# EasyEDA Pro project zdiy1.eprj, board PCB1
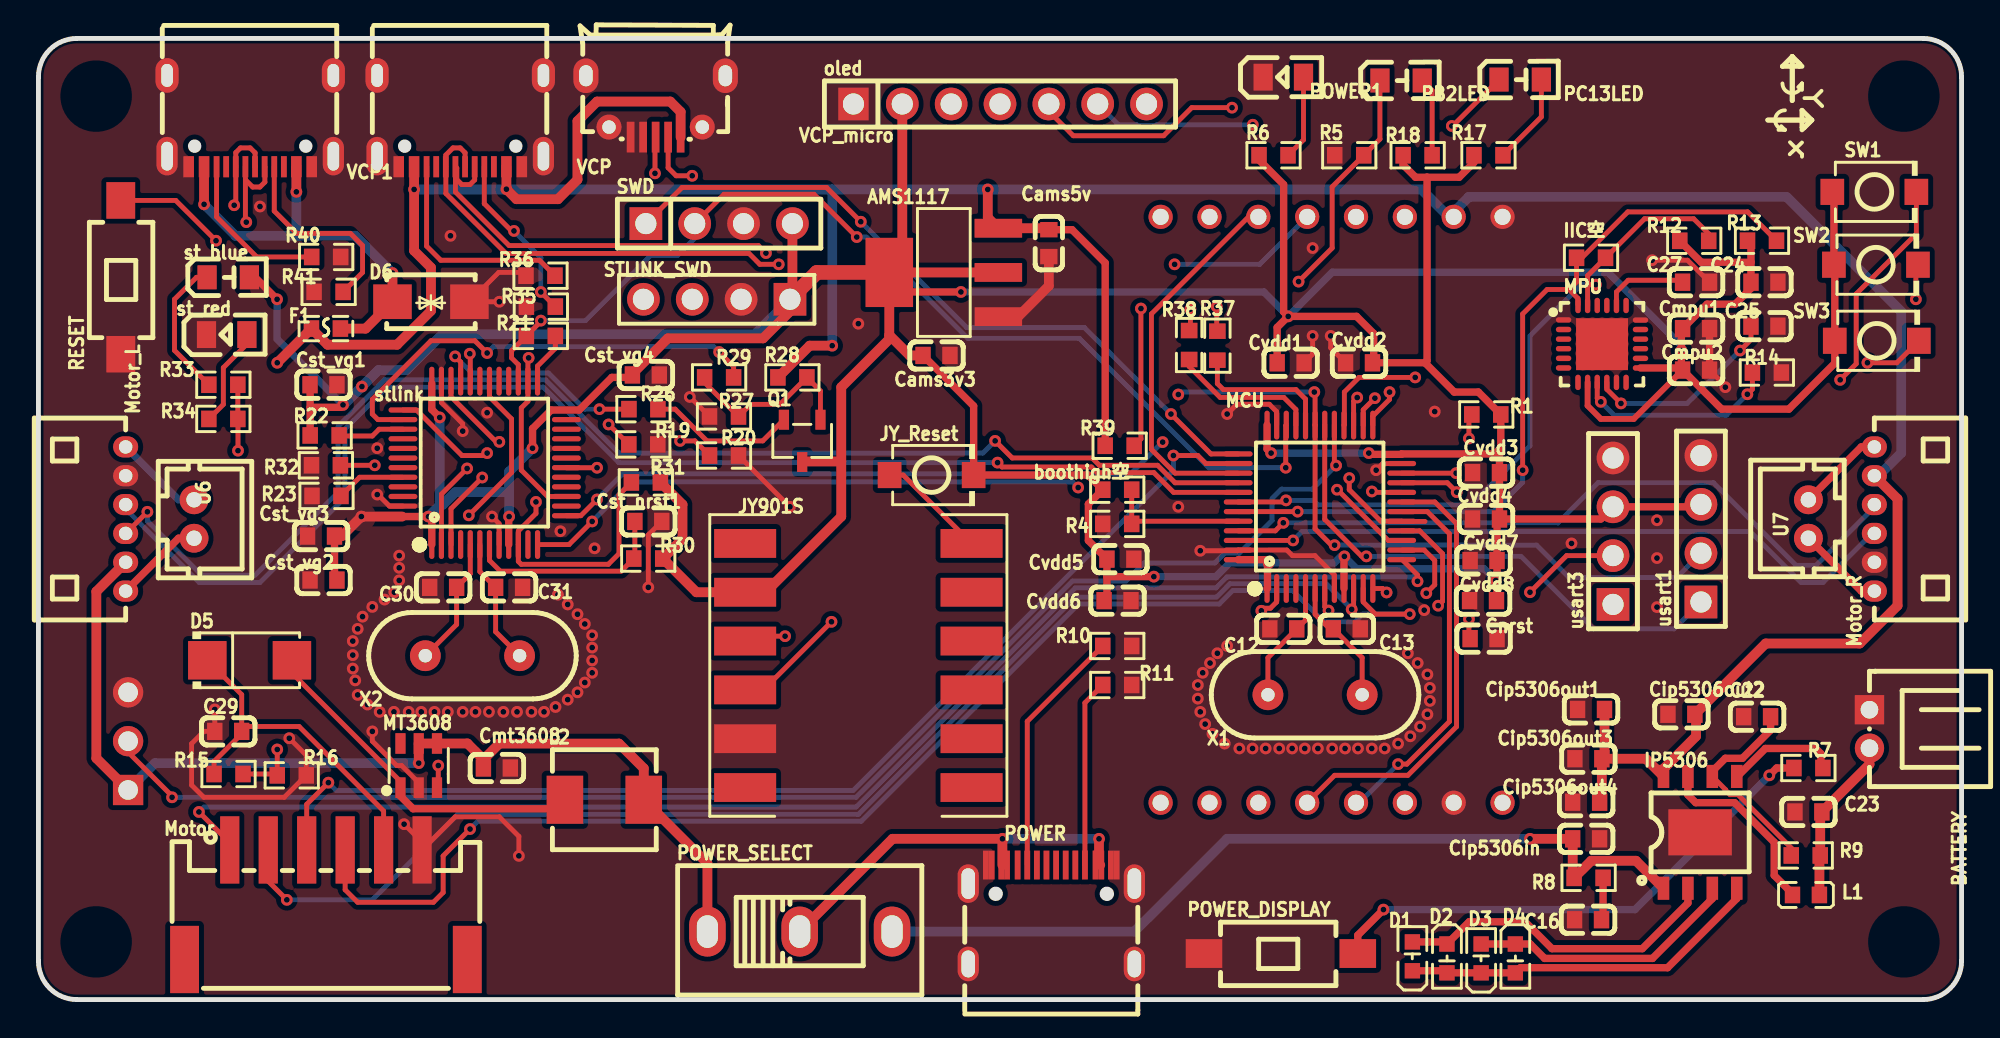
[diagram p4: board, top side]
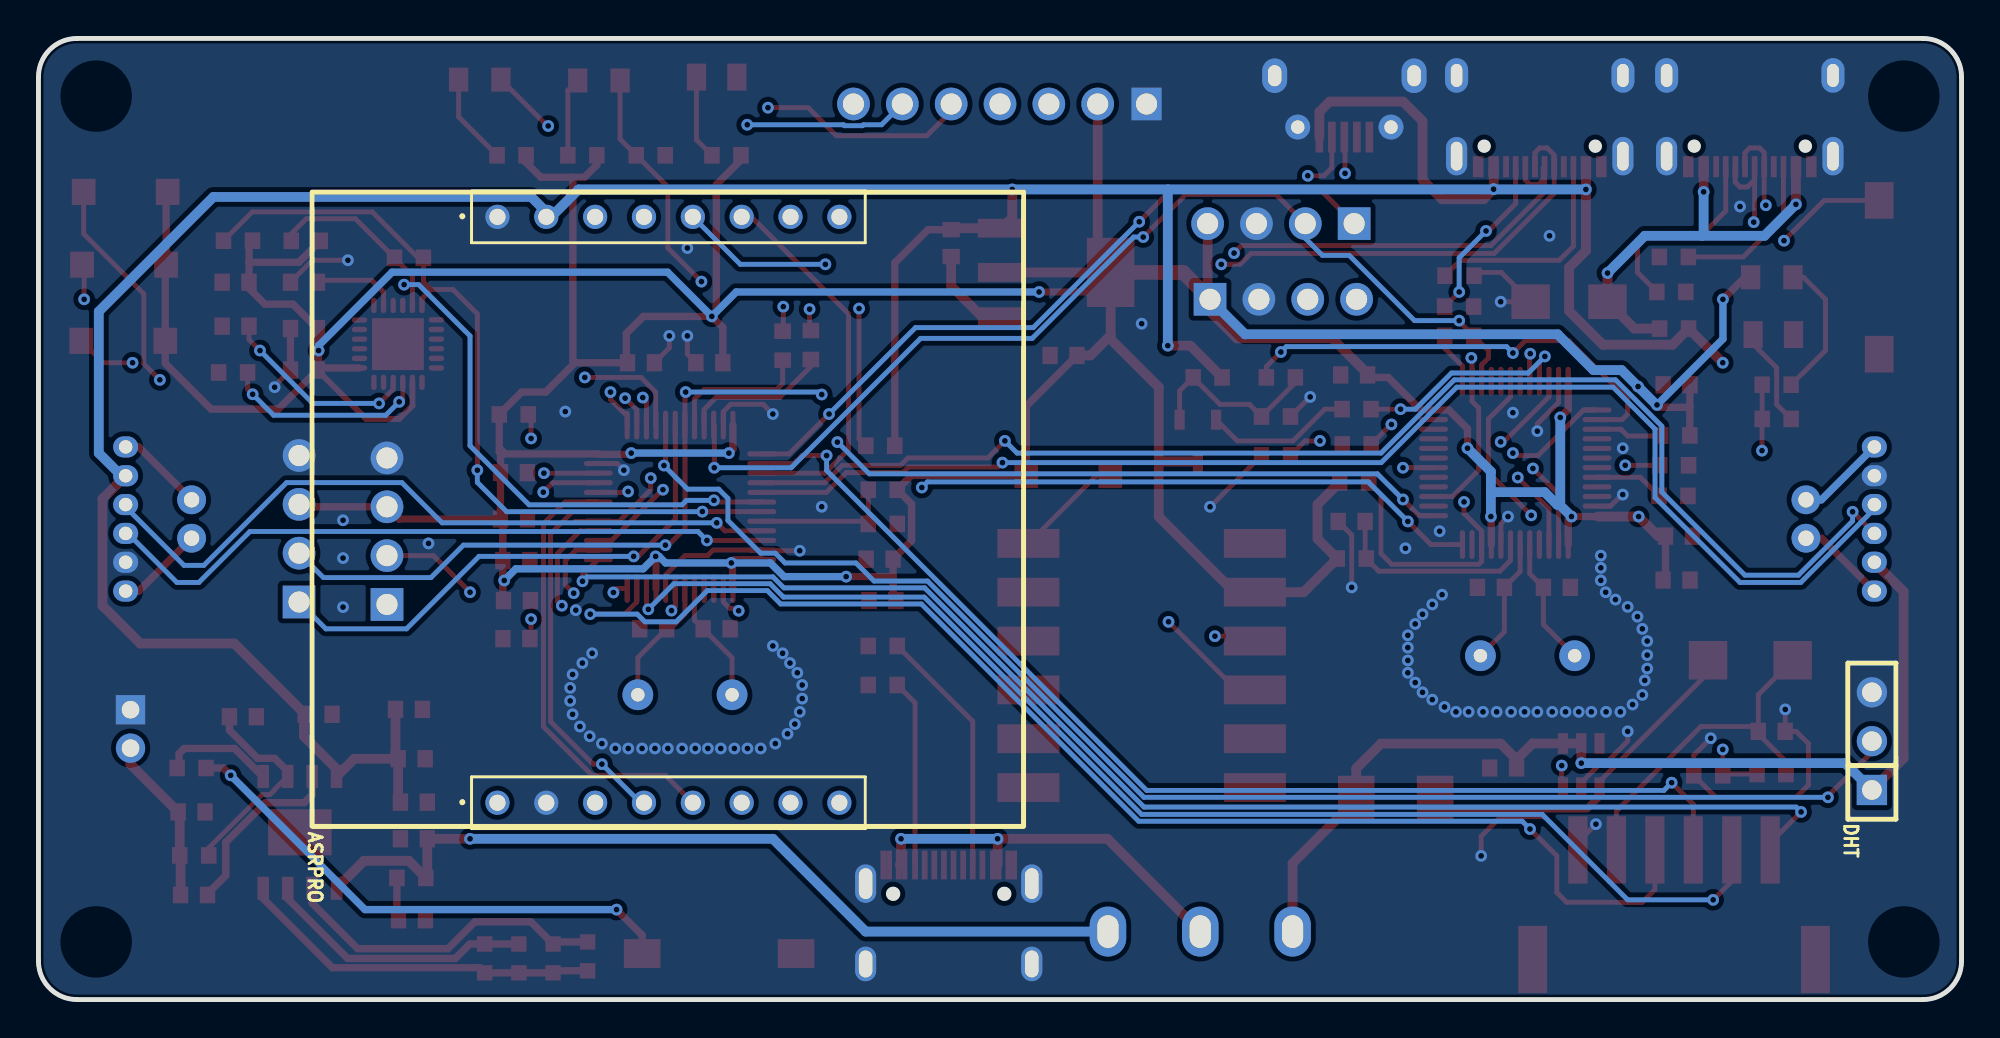
[diagram p5: board, bottom side, seen from below]

Outline 100 x 50 mm; copper layers: Top Layer, Inner1, Inner2, Bottom Layer. Coordinates in mm from the lower left corner of the outline.
Outline path: 0,48 0,2 arc(0.59,0.59) 2,0 98,0 arc(99.41,0.59) 100,2 100,48 arc(99.41,49.41) 98,50 2,50 arc(0.59,49.41) 0,48
Stack: Top Layer 0.035mm 外层铜厚1oz / Dielectric1 0.2104mm 7628 RC49% 8.6mil / Inner1 0.0152mm 内层铜厚 / Dielectric2 1.065mm 1.1mm H/HOZ Copper / Inner2 0.0152mm 内层铜厚 / Dielectric3 0.2104mm 7628 RC49% 8.6mil / Bottom Layer 0.035mm 外层铜厚1oz

## Design rules (mm)
net PA11: DP2
net PA12: DP2
net ST_USB+: DP3
net ST_USB-: DP3
net USB_DM: DP4
net USB_DP: DP4
template: 自定义配置
spacing copperThickness1oz (default): track to track 0.102, other pairs 0.152 to 0.3
spacing copperThickness2oz: track to track 0.203, other pairs 0.152 to 0.3
track width copperThickness1oz (default): min 0.127, default 0.254, max 2.54
track width copperThickness2oz: min 0.203, default 0.254, max 2.54
differential pair differentialPair (default): width min 0.127, default 0.254, max 2.54; gap min 0.152, default 0.152
via viaSize (default): diameter min 0.5, default 0.61, max 10; hole min 0.3, default 0.305, max 6.3
net GND uses copperRegion2
net +5V uses copperRegion2

## Placement (name value [footprint] x y rotation side)
AMS1117  AMS1117-3.3  [SOT-223-4_L6.5-W3.5-P2.30-LS7.0-BR]  47.08 37.83 0 top
ASRPRO  ASRPRO  [asrpro_fz]  67.27 25.51 90 bottom
BATTERY  WAFER-PH2.0-2PWZ  [CONN-TH_2P-P2.00_GP01-2001WR-2P]  95.21 14.08 270 top
boothigh空  10kΩ  [R0603]  56.1 26.52 180 top
C12  20pF  [C0603]  64.73 19.28 0 top
C13  20pF  [C0603]  68.03 19.28 180 top
C16  10uF  [C0603]  80.58 4.15 0 top
C22  22uF  [C0603]  89.37 14.71 0 top
C23  22uF  [C0603]  92.04 9.76 180 top
C24  10nF  [C0603]  89.75 37.32 0 top
C25  100nF  [C0603]  89.75 35.03 180 top
C27  2.2nF  [C0603]  86.19 37.32 180 top
C29  22uF  [C0603]  9.87 13.95 0 top
C30  20pF  [C0603]  21.04 21.44 0 top
C31  20pF  [C0603]  24.47 21.44 180 top
Cams3v3  2.2uF  [C0603]  46.7 33.51 0 top
Cams5v  2.2u  [C0603]  52.54 39.35 270 top
Cip5306in  10uF  [C0603]  80.48 8.36 180 top
Cip5306out1  22uF  [C0603]  80.73 15.09 180 top
Cip5306out2  22uF  [C0603]  85.43 14.84 180 top
Cip5306out3  22uF  [C0603]  80.6 12.53 180 top
Cip5306out4  22uF  [C0603]  80.48 10.27 180 top
Cmpu1  100nF  [C0603]  86.19 34.91 180 top
Cmpu2  22uF  [C0603]  86.19 32.75 180 top
Cmt3608  22uF  [C0603]  23.84 12.05 180 top
Cnrst  100nF  [C0603]  75.15 18.78 0 top
Cst_nrst1  100nF  [C0603]  31.71 24.87 0 top
Cst_vg1  100nF  [C0603]  14.82 31.98 0 top
Cst_vg2  100nF  [C0603]  14.82 21.83 180 top
Cst_vg3  100nF  [C0603]  14.69 24.11 180 top
Cst_vg4  100nF  [C0603]  31.59 32.49 0 top
Cvdd1  100nF  [C0603]  65.11 33.13 180 top
Cvdd2  100nF  [C0603]  68.67 33.13 0 top
Cvdd3  100nF  [C0603]  75.27 27.41 0 top
Cvdd4  100nF  [C0603]  75.27 25 0 top
Cvdd5  100nF  [C0603]  56.26 22.91 180 top
Cvdd6  4.7uF  [C0603]  56.11 20.75 180 top
Cvdd7  1uF  [C0603]  75.15 22.84 0 top
Cvdd8  10nF  [C0603]  75.12 20.75 180 top
D1  XL-J1608UGC-06  [LED-SMD_XL-J1608UYC-06]  71.44 2.25 270 top
D2  XL-J1608UGC-06  [LED-SMD_XL-J1608UYC-06]  73.24 2.14 90 top
D3  XL-J1608UGC-06  [LED-SMD_XL-J1608UYC-06]  75.02 2.14 270 top
D4  XL-J1608UGC-06  [LED-SMD_XL-J1608UYC-06]  76.8 2.14 90 top
D5  SS34  [SMA_L4.3-W2.6-LS5.2-RD]  10.98 17.65 0 top
D6  SMAJ6.8CA  [SMA_L4.4-W2.6-LS5.0-BI]  20.41 36.3 0 top
DHT  PM254V-11-03-H85  [HDR-TH_3P-P2.54-V-F]  4.66 13.44 90 bottom
F1  BSMD0603-050-6V  [F0603]  14.95 34.91 180 top
IIC空  4.7kΩ  [R0603]  80.73 38.59 180 top
IP5306  IP5306  [ESOP-8_L4.9-W3.9-P1.27-LS6.0-BL-EP]  86.41 8.7 0 top
JY901S  -  [JY901S]  42.63 17.38 0 top
JY_Reset  TS-1088R-02026  [SW-SMD_L3.9-W3.0-P4.45]  46.44 27.29 0 top
L1  1uH  [L0603]  91.91 5.44 0 top
L2  4.7uH  [IND-SMD_L5.4-W5.2_FXL0530]  29.43 10.39 0 top
MCU  STM32F103CBT6  [LQFP-48_L7.0-W7.0-P0.50-LS9.0-BL]  66.64 25.64 0 top
Motor  WAFER-PH2.0-6PWB  [CONN-SMD_6P-P2.00_XUNPU_WAFER-PH2.0-6PWB]  14.95 4.93 0 top
Motor_L  HC-ZH1.5-6AW  [CONN-TH_6P-P1.50_HCTL_C-ZH1.5-6AW]  4.53 25 270 top
Motor_R  HC-ZH1.5-6AW  [CONN-TH_6P-P1.50_HCTL_C-ZH1.5-6AW]  95.47 25 90 top
MPU  MPU-6050  [QFN-24_L4.0-W4.0-P0.50-BL-EP2.7]  81.31 34.11 270 top
MT3608  MT3608  [SOT-23-6_L2.9-W1.6-P0.95-LS2.8-BL]  19.77 12.17 0 top
oled  PM254V-11-07-H85  [HDR-TH_7P-P2.54-V-F]  50 46.59 0 top
PB2LED  XL-2012UBC  [LED0805-RD]  70.86 47.81 0 top
PC13LED  XL-2012UBC  [LED0805-RD]  77.05 47.86 0 top
POWER  TYPE-C母座16P不绣钢  [TYPE-C-SMD_16P-EH4]  52.67 4.43 0 top
POWER1  NCD0805R1  [LED0805-R-RD]  64.73 47.99 0 top
POWER_DISPLAY  TS-1101-C-W  [SW-SMD_L6.0-W3.3-LS8.0]  64.6 2.39 0 top
POWER_SELECT  SS-12D10G3-G  [SW-TH_3P-L12.7-W6.7-P4.80_SS-12D10G10-G]  39.59 3.54 0 top
Q1  S8050 J3Y(RANGE:200-350)  [SOT-23-3_L3.0-W1.7-P0.95-LS2.9-BR]  39.71 29.06 90 top
R1  5.1kΩ  [R0603]  75.29 30.44 180 top
R4  4.7kΩ  [R0603]  56.1 24.75 0 top
R5  4.7kΩ  [R0603]  68.16 43.92 0 top
R6  4.7kΩ  [R0603]  64.22 43.92 0 top
R7  10kΩ  [R0603]  92.04 12.05 0 top
R8  2Ω  [R0603]  80.61 6.33 180 top
R9  500mΩ  [R0603]  91.9 7.5 0 top
R10  5.1kΩ  [R0603]  56.1 18.4 0 top
R11  5.1kΩ  [R0603]  56.1 16.36 180 top
R12  4.7kΩ  [R0603]  86.1 39.47 180 top
R13  4.7kΩ  [R0603]  89.62 39.48 180 top
R14  4.7kΩ  [R0603]  89.88 32.62 180 top
R15  9kΩ  [R0603]  9.88 11.73 180 top
R16  1kΩ  [R0603]  13.17 11.67 180 top
R17  4.7kΩ  [R0603]  75.4 43.92 0 top
R18  4.7kΩ  [R0603]  71.72 43.92 0 top
R19  10kΩ  [R0603]  31.45 28.88 180 top
R20  10kΩ  [R0603]  35.65 28.3 180 top
R21  100Ω  [R0603]  26.12 34.53 180 top
R22  4.7kΩ  [R0603]  14.88 29.35 180 top
R23  10kΩ  [R0603]  14.98 26.2 180 top
R26  1.5kΩ  [R0603]  31.46 30.72 180 top
R27  36kΩ  [R0603]  35.65 30.33 0 top
R28  10kΩ  [R0603]  39.21 32.37 180 top
R29  100Ω  [R0603]  35.4 32.37 0 top
R30  5.1kΩ  [R0603]  31.71 22.94 180 top
R31  5.1kΩ  [R0603]  31.59 26.91 180 top
R32  5.1kΩ  [R0603]  14.95 27.79 180 top
R33  510Ω  [R0603]  9.61 31.98 180 top
R34  510Ω  [R0603]  9.61 30.21 180 top
R35  5.1kΩ  [R0603]  26.12 36.05 0 top
R36  5.1kΩ  [R0603]  26.11 37.66 0 top
R37  100Ω  [R0603]  61.3 34.02 90 top
R38  100Ω  [R0603]  59.83 34.05 90 top
R39  10kΩ  [R0603]  56.22 28.81 180 top
R40  5.1kΩ  [R0603]  14.96 38.63 180 top
R41  5.1kΩ  [R0603]  15.09 36.82 0 top
RESET  TS-1101-C-W  [SW-SMD_L6.0-W3.3-LS8.0]  4.28 37.57 90 top
st_blue  XL-2012UBC  [LED0805-RD]  9.87 37.57 0 top
st_red  NCD0805R1  [LED0805-R-RD]  9.79 34.59 0 top
stlink  STM32F103CBT6  [LQFP-48_L7.0-W7.0-P0.50-LS9.0-BL]  23.2 27.92 0 top
STLINK_SWD  IPCP254M04PB08V  [HDR-TH_4P-P2.54-V-M-1]  35.27 36.43 180 top
SW1  TS-1088R-02026  [SW-SMD_L3.9-W3.0-P4.45]  95.47 42.02 0 top
SW2  TS-1088R-02026  [SW-SMD_L3.9-W3.0-P4.45]  95.55 38.23 0 top
SW3  TS-1088R-02026  [SW-SMD_L3.9-W3.0-P4.45]  95.59 34.27 0 top
SWD  2.54-1*4P母  [HDR-TH_4P-P2.54-V-F]  35.4 40.37 0 top
U6  WAFER-PH2.0-2PZZ  [CONN-TH_2P-P2.00_HC-PH-2A-M]  8.09 25 270 top
U7  WAFER-PH2.0-2PZZ  [CONN-TH_2P-P2.00_HC-PH-2A-M]  92.04 25 90 top
usart1  PZ254V-11-04P  [HDR-TH_4P-P2.54-V-M]  86.45 24.49 90 top
usart3  PZ254V-11-04P  [HDR-TH_4P-P2.54-V-M]  81.88 24.36 90 top
VCP  TYPE-C 16PIN 2MD(073)  [USB-C-SMD_TYPE-C-6PIN-2MD-073]  21.93 45.7 180 top
VCP1  TYPE-C 16PIN 2MD(073)  [USB-C-SMD_TYPE-C-6PIN-2MD-073]  11.01 45.7 180 top
VCP_micro  MicroXNJ  [MICRO-USB-SMD_MICROXNJ]  32.09 46.46 180 top
X1  8MHz  [OSC-TH_L10.0-W4.5-P5.00]  66.38 15.86 90 top
X2  8MHz  [OSC-TH_L10.0-W4.5-P5.00]  22.57 17.89 90 top

## Footprints (pads in the part's own frame, mm; a bottom-side part is the same pattern mirrored in y, then rotated)
asrpro_fz
  round 1.26 hole 0.84: 1(-15.269,8.861) 2(-15.269,6.321) 3(-15.269,3.781) 4(-15.269,1.241) 5(-15.269,-1.299) 6(-15.269,-3.839) 7(-15.269,-6.379) 8(-15.269,-8.919) 9(15.211,-8.919) 10(15.211,-6.379) 11(15.211,-3.839) 12(15.211,-1.299) 13(15.211,1.241) 14(15.211,3.781) 15(15.211,6.321) 16(15.211,8.861)
C0603
  rect 0.8x0.9 smd: 1(-0.7,0) 2(0.7,0)
CONN-SMD_6P-P2.00_XUNPU_WAFER-PH2.0-6PWB
  rect 1x3.5 smd: 1(-5,2.85) 2(-3,2.85) 3(-1,2.85) 4(1,2.85) 5(3,2.85) 6(5,2.85)
  rect 1.5x3.5 smd: 7(-7.35,-2.85) 8(7.35,-2.85)
CONN-TH_2P-P2.00_GP01-2001WR-2P
  rect 1.524x1.524 hole 0.914: 1(-1,0)
  round 1.524 hole 0.914: 2(1,0)
CONN-TH_2P-P2.00_HC-PH-2A-M
  round 1.5 hole 0.8: 1(-1,0) 2(1,0)
CONN-TH_6P-P1.50_HCTL_C-ZH1.5-6AW
  oval 1.1x1.3 hole 0.7: 1(-3.75,0) 2(-2.25,0) 3(-0.75,0) 4(0.75,0) 5(2.25,0) 6(3.75,0)
ESOP-8_L4.9-W3.9-P1.27-LS6.0-BL-EP
  rect 0.6x1.2 smd: 1(-1.905,-2.909) 2(-0.635,-2.909) 3(0.635,-2.909) 4(1.905,-2.909) 5(1.905,2.909) 6(0.635,2.909) 7(-0.635,2.909) 8(-1.905,2.909)
  rect 3.3x2.4 smd: 9(0,0)
F0603
  rect 0.806x0.864 smd: 1(-0.753,0) 2(0.753,0)
HDR-TH_3P-P2.54-V-F
  rect 1.575x1.575 hole 1.02: 1(-2.54,0)
  round 1.575 hole 1.02: 2(0,0) 3(2.54,0)
HDR-TH_4P-P2.54-V-F
  rect 1.7x1.7 hole 1.1: 1(-3.81,0)
  round 1.7 hole 1.1: 2(-1.27,0) 3(1.27,0) 4(3.81,0)
HDR-TH_4P-P2.54-V-M
  rect 1.7x1.7 hole 1.1: 1(-3.81,0)
  round 1.7 hole 1.1: 2(-1.27,0) 3(1.27,0) 4(3.81,0)
HDR-TH_4P-P2.54-V-M-1
  rect 1.7x1.7 hole 1.1: 1(-3.81,0)
  round 1.7 hole 1.1: 2(-1.27,0) 3(1.27,0) 4(3.81,0)
HDR-TH_7P-P2.54-V-F
  rect 1.575x1.7 hole 1.1: 1(-7.62,0)
  round 1.7 hole 1.1: 2(-5.08,0) 3(-2.54,0) 4(0,0) 5(2.54,0) 6(5.08,0) 7(7.62,0)
IND-SMD_L5.4-W5.2_FXL0530
  rect 1.9x2.5 smd: 1(-2.05,0) 2(2.05,0)
JY901S
  rect 3.225x1.5 smd: 1(-5.888,6.35) 2(-5.888,3.81) 3(-5.888,1.27) 4(-5.888,-1.27) 5(-5.888,-3.81) 6(-5.888,-6.35) 7(5.888,-6.35) 8(5.888,-3.81) 9(5.888,-1.27) 10(5.888,1.27) 11(5.888,3.81) 12(5.888,6.35)
L0603
  rect 0.8x0.864 smd: 1(-0.7,0) 2(0.7,0)
LED0805-R-RD
  rect 1x1.399 smd: 1(1.05,0) 2(-1.05,0)
LED0805-RD
  rect 1x1.25 smd: 1(-1.1,0) 2(1.1,0)
LED-SMD_XL-J1608UYC-06
  rect 0.8x0.8 smd: 1(0.75,0) 2(-0.75,0)
LQFP-48_L7.0-W7.0-P0.50-LS9.0-BL
  oval 0.27x1.5 smd: 1(-2.75,-4.25) 2(-2.25,-4.25) 3(-1.75,-4.25) 4(-1.25,-4.25) 5(-0.75,-4.25) 6(-0.25,-4.25) 7(0.25,-4.25) 8(0.75,-4.25) 9(1.25,-4.25) 10(1.75,-4.25) 11(2.25,-4.25) 12(2.75,-4.25) 25(2.75,4.25) 26(2.25,4.25) 27(1.75,4.25) 28(1.25,4.25) 29(0.75,4.25) 30(0.25,4.25) 31(-0.25,4.25) 32(-0.75,4.25) 33(-1.25,4.25) 34(-1.75,4.25) 35(-2.25,4.25) 36(-2.75,4.25)
  oval 1.5x0.27 smd: 13(4.25,-2.75) 14(4.25,-2.25) 15(4.25,-1.75) 16(4.25,-1.25) 17(4.25,-0.75) 18(4.25,-0.25) 19(4.25,0.25) 20(4.25,0.75) 21(4.25,1.25) 22(4.25,1.75) 23(4.25,2.25) 24(4.25,2.75) 37(-4.25,2.75) 38(-4.25,2.25) 39(-4.25,1.75) 40(-4.25,1.25) 41(-4.25,0.75) 42(-4.25,0.25) 43(-4.25,-0.25) 44(-4.25,-0.75) 45(-4.25,-1.25) 46(-4.25,-1.75) 47(-4.25,-2.25) 48(-4.25,-2.75)
MICRO-USB-SMD_MICROXNJ
  rect 0.4x1.6 smd: 1(-1.3,1.597) 2(-0.65,1.597) 3(0,1.597) 4(0.65,1.597) 5(1.3,1.597)
  round 1.3 hole 0.7: 6(2.425,1.074) 9(-2.425,1.073)
  oval 1.3x1.8 hole 0.7x1.1: 7(3.625,-1.597) 8(-3.625,-1.597)
OSC-TH_L10.0-W4.5-P5.00
  round 1.6 hole 0.7: 1(0,2.45) 2(0,-2.45)
QFN-24_L4.0-W4.0-P0.50-BL-EP2.7
  oval 0.28x0.8 smd: 1(-1.25,-2) 2(-0.75,-2) 3(-0.25,-2) 4(0.25,-2) 5(0.75,-2) 6(1.25,-2) 13(1.25,2) 14(0.75,2) 15(0.25,2) 16(-0.25,2) 17(-0.75,2) 18(-1.242,2)
  oval 0.8x0.28 smd: 7(2,-1.25) 8(2,-0.75) 9(2,-0.25) 10(2,0.25) 11(2,0.75) 12(2,1.25) 19(-2,1.25) 20(-2,0.75) 21(-2,0.25) 22(-2,-0.25) 23(-2,-0.75) 24(-2,-1.25)
  rect 2.7x2.7 smd: 25(0.013,0)
R0603
  rect 0.806x0.864 smd: 1(-0.753,0) 2(0.753,0)
SMA_L4.3-W2.6-LS5.2-RD
  rect 2x2 smd: 1(-2.2,0) 2(2.2,0)
SMA_L4.4-W2.6-LS5.0-BI
  rect 2x1.8 smd: 1(-2,0) 2(2,0)
SOT-23-3_L3.0-W1.7-P0.95-LS2.9-BR
  rect 1.038x0.532 smd: 1(1.101,-0.95) 2(1.101,0.95) 3(-1.101,0)
SOT-23-6_L2.9-W1.6-P0.95-LS2.8-BL
  rect 0.532x1.072 smd: 1(-0.95,-1.149) 2(0,-1.149) 3(0.95,-1.149) 4(0.95,1.149) 5(0,1.149) 6(-0.95,1.149)
SOT-223-4_L6.5-W3.5-P2.30-LS7.0-BR
  rect 2.47x0.98 smd: 1(2.835,-2.3) 2(2.835,0) 3(2.835,2.3)
  rect 2.47x3.6 smd: 4(-2.835,0)
SW-SMD_L3.9-W3.0-P4.45
  rect 1.23x1.36 smd: 1(-2.185,0) 2(2.185,0)
SW-SMD_L6.0-W3.3-LS8.0
  rect 1.9x1.5 smd: 1(-4,0) 2(4,0)
SW-TH_3P-L12.7-W6.7-P4.80_SS-12D10G10-G
  oval 1.9x2.6 hole 1.1x1.7: 1(-4.8,0) 2(0,0) 3(4.8,0)
TYPE-C-SMD_16P-EH4
  oval 1.1x2 hole 0.7x1.6: 1(-4.32,1.606) 1(4.32,1.606)
  oval 1.1x1.8 hole 0.7x1.4: 1(-4.32,-2.574) 1(4.32,-2.574)
  rect 0.3x1.5 smd: A1(-3.4,2.573) A4(-2.6,2.573) A5(-1.25,2.573) A6(-0.25,2.573) A7(0.25,2.573) A8(1.25,2.574) A9(2.6,2.574) A12(3.4,2.573) B1(3.1,2.573) B4(2.3,2.574) B5(1.75,2.573) B6(0.75,2.573) B7(-0.75,2.573) B8(-1.75,2.574) B9(-2.3,2.573) B12(-3.1,2.573)
USB-C-SMD_TYPE-C-6PIN-2MD-073
  rect 0.55x1.1 smd: 1(-3.2,2.375) 2(-2.4,2.375) 11(2.4,2.375) 12(3.2,2.375)
  rect 0.3x1.1 smd: 3(-1.75,2.375) 4(-1.25,2.375) 5(-0.75,2.375) 6(-0.25,2.375) 7(0.25,2.375) 8(0.75,2.375) 9(1.25,2.375) 10(1.75,2.375)
  oval 1.1x2 hole 0.6x1.5: 13(-4.325,1.825) 14(4.325,1.825)
  oval 1.2x1.8 hole 0.6x1.2: 13(-4.325,-2.375) 14(4.325,-2.375)

## Nets
As in the schematic.

Pads without a net: ASRPRO 1 3 6 7 8 9 10 13 14; JY901S 1 6 7 8 9 10 11; Motor 7 8; MPU 2 3 4 5 6 7 12 14 15 16 17 19 21 22; MT3608 6; POWER A6 A7 A8 B6 B7 B8; stlink 4 11 14 16 17 19 21 22 28 29 31 40 41 42 43 45 46; VCP 3 9; VCP1 3 9

## Via types
v1: diameter 0.61, hole 0.305, Top Layer to Bottom Layer, 230 vias

## Routing (per net, layer and track width the routed paths; a pad name or vN(x,y) marks a point on that pad's centre or on a via; arc(x,y) is an arc through that point)
3V3: length 355.9
  Top Layer w0.305: Cmpu2.2 82.96,30.21 81.24,30.21 80.56,30.89 MPU.8
  Top Layer w0.381: Cst_vg1.1 14.13,31.98 14.13,30.81 ; R22.2 14.13,30.81 ; 14.13,30.81 15.71,30.81 v1(15.84,30.94) ; 89.05,38.36 86.46,38.36 R12.2 ; 89.05,38.36 89.05,39.3 R13.2 ; 89.05,38.36 C24.1 89.05,37 88.23,36.18 86.76,36.18 Cmpu1.2 85.43,34.84 v1(85.43,33.76) 85.43,32.81 85.38,32.86 MPU.13 ; R18.1 70.96,43.42 71.61,42.78 72.21,42.78 ; stlink.24 26.66,30.67 25.69,29.7 v1(25.69,28.68) ; MCU.36 63.89,28.64 v1(64.1,28.43) ; Cst_vg3.1 15.39,21.95 Cst_vg2.1 ; 72.21,42.78 73.88,42.78 74.65,43.55 R17.1 ; 72.21,42.78 72.21,33.24 72.1,33.13 ; AMS1117.4 45.26,36.81 v1(47.97,36.81) ; stlink.1 20.45,24.96 v1(20.28,25.13) 19,25.13 ; v1(64.99,35.54) 64.75,35.78 64.75,42.4 63.47,43.68 R6.1 ; v1(64.99,35.54) 68.54,35.54 69.43,34.65 69.43,33.19 Cvdd2.2 72.1,33.13 ; v1(64.99,35.54) 64.41,34.97 Cvdd1.2 ; 27.58,30.67 28.12,30.67 29.81,32.37 31.01,32.37 ; SW1.1 93.36,41.94 SW2.1 93.41,38.19 SW3.1 93.41,33.1 91.02,30.72 87.53,30.72 Cmpu2.2 ; Cvdd8.1 75.85,20.78 Cvdd7.2 75.85,24.87 Cvdd4.2 ; Cvdd6.2 55.56,20.9 55.56,22 ; 55.56,22 Cvdd5.2 54.6,23.88 54.6,25.78 boothigh空.2 54.58,27.29 JY_Reset.2 48.63,30.88 Cams3v3.1 ; 55.56,22 v1(58,22) ; 72.1,33.13 73.62,31.6 74.88,31.6 R1.1 76.04,28.49 75.97,28.42 ; v1(12.41,36.43) 11.27,37.57 st_blue.2 ; Cvdd4.2 81.24,25 81.88,25.64 86.32,25.64 usart1.3 ; Cvdd4.2 Cvdd3.2 75.97,28.42 ; v1(69.18,28.43) 69.24,28.36 70.86,28.36 MCU.24 75.73,28.39 75.97,28.63 75.97,28.42 ; v1(20.87,30.28) 20.45,30.7 20.45,32.04 ; v1(24.47,25.13) 24.45,25.11 stlink.9 ; MCU.48 63.8,22.89 v1(63.97,22.71) 63.91,22.65 63.91,21.41 MCU.1 ; v1(67.91,23.06) 67.89,23.04 MCU.9
  Top Layer w0.508: 41.75,28 39.75,28 Q1.3 ; 41.75,28 41.75,31.86 44.24,34.36 44.24,34.57 ; 41.75,28 41.75,25.13 37.81,21.19 JY901S.2 34.21,21.19 R30.1 33.49,23.97 33.49,25.75 R31.1 ; 44.24,34.57 45.3,33.51 Cams3v3.1 ; 44.24,34.57 AMS1117.4 ; AMS1117.4 AMS1117.2 ; AMS1117.4 44.92,38.5 oled.2 ; 31.01,32.37 31.01,32.68 32.73,34.4 37.68,34.4 39.08,35.8 STLINK_SWD.1 ; SWD.4 39.21,36.56 ; 18.91,25.13 16.85,25.13 16.82,25.16 15.78,24.11 Cst_vg3.1
  Top Layer w0.762: AMS1117.4 40.47,37.83 39.21,36.56
  Inner1 w0.381: v1(16.82,31.89) 16.82,25.16 v1(16.79,25.13)
  Bottom Layer w0.381: v1(58,22) 61.23,22 61.94,22.71 v1(63.97,22.71) 67.39,22.71 67.73,23.06 v1(67.91,23.06) 68.55,22.41 75.17,22.41 v1(75.78,21.8) ; v1(47.97,36.81) 63.72,36.81 v1(64.99,35.54) 67.28,37.84 81.61,37.84 85.43,34.02 v1(85.43,33.76) ; v1(64.1,28.43) v1(69.18,28.43) ; v1(15.84,30.94) 12.41,34.36 v1(12.41,36.43)
  Bottom Layer w0.508: 24.47,26.4 v1(24.47,25.13) ; 24.47,26.4 24.47,27.46 v1(25.69,28.68) ; 24.47,26.4 21.68,26.4 21.03,25.75 ; 21.03,25.75 20.87,25.91 v1(20.87,30.28) ; 21.03,25.75 20.9,25.75 v1(20.28,25.13) ; STLINK_SWD.1 37.26,34.61 21,34.61 19.14,32.75 17.68,32.75 v1(16.82,31.89) 15.87,30.94 v1(15.84,30.94)
5V_IN: length 20.3
  Top Layer w0.508: 55.21,7 55.15,7.06 v1(55.15,8.36) ; POWER_SELECT.2 44.41,8.36 v1(50.13,8.36) 50.12,8.36 50.12,7
  Bottom Layer w0.508: v1(55.15,8.36) v1(50.13,8.36)
6V: length 18.6
  Top Layer w0.254: R15.2 9.13,12.39 10.57,13.82 C29.2 ; C29.2 10.82,14.2 13.55,14.2 17.95,9.81 Motor.5 ; C29.2 10.57,15.86 D5.1
+5V: length 255.4
  Top Layer w0.381: R39.2 55.47,38.33 53.74,40.05 Cams5v.1
  Top Layer w0.508: R28.2 40.1,34.02 v1(41.27,34.02) ; Cip5306out3.1 81.43,12.67 Cip5306out1.1 ; Cip5306out3.1 83.58,12.53 IP5306.8 84.5,12 86.19,13.7 86.19,14.78 Cip5306out2.1 89.82,18.52 94.7,18.52 96.67,20.49 96.67,26.04 Motor_R.5 ; Cip5306out3.1 81.3,10.38 Cip5306out4.1 ; v1(49.37,42.14) 49.37,40.68 AMS1117.3 52.46,40.13 Cams5v.1 ; 4.66,10.9 3.01,12.55 3.01,21.23 Motor_L.5 ; v1(19.77,12.3) MT3608.5 MT3608.4 22.31,13.32 23.14,12.49 ; VCP_micro.1 33.39,46.18 32.85,46.72 29.04,46.72 28.03,45.7 28.03,42.65 27.01,41.64 24.85,41.64 v1(24.33,42.16) 24.33,43.33 ; VCP.11 v1(19.53,42.14) 19.53,38.96 20.41,38.08 20.41,35.83 18.65,34.07 15.03,34.07 F1.2 v1(12.42,33.13) ; POWER_SELECT.1 34.79,7.08 L2.2 31.48,12.03 30.19,13.32 23.97,13.32 23.14,12.49 Cmt3608.2
  Inner1 w0.508: v1(12.42,33.13) 7.71,33.13 6.44,31.86 6.44,24.66 Motor_L.5
  Bottom Layer w0.508: v1(19.77,12.3) 6.06,12.3 4.66,10.9 ; 41.27,42.14 v1(41.27,34.02) ; 41.27,42.14 v1(49.37,42.14) 71.91,42.14 73.34,40.72 74.38,41.75 90.9,41.75 96.86,35.8 96.86,28.43 95.68,27.25 Motor_R.5 ; 41.27,42.14 v1(19.53,42.14)
GND: length 75.5
  Top Layer w0.254: v1(60.41,23.35) 62.35,23.35 MCU.47 64.91,23.39 65.2,23.09 66.38,23.09 67.39,22.09 MCU.8 ; R36.1 25.18,37.83 23.93,37.83 D6.2 v1(23.97,36.3) ; v1(24.98,7.47) 24.98,8.49 23.97,9.51 21.67,9.51 Motor.6 19.95,8.19 v1(19.01,9.12) ; R27.1 33.88,31.35 v1(33.87,31.35) ; stlink.35 20.95,31.06 22.06,29.95 v1(22.06,29.57) ; v1(17.36,13.95) 17.36,13.44 18.63,12.17 18.89,12.17 19.77,11.28 MT3608.2 ; v1(61.81,30.46) 62.32,30.97 64,30.97 64.39,30.59 MCU.35 ; v1(9.17,15.09) C29.1 8.6,13.95 7.96,13.32 7.96,11.16 8.6,10.52 12.78,10.52 R16.1 13.92,12.71 v1(13.04,13.59) ; v1(39.08,25.64) 39.07,25.64 R20.1 ; v1(67.2,34.53) 67.2,33.9 67.97,33.13 ; v1(66.26,34.53) 66.26,33.57 Cvdd1.1 ; 86.9,37.32 85.75,38.46 v1(83.91,38.46) ; stlink.8 23.95,24.76 v1(23.58,25.13) ; MCU.23 69.9,27.89 v1(69.56,27.54) ; 86.9,32.75 87.72,31.92 v1(87.72,31.86) ; Cst_nrst1.2 31.71,24.17 v1(31.71,21.44) ; v1(17.61,26.27) 17.65,26.27 18.25,25.67 stlink.47
  Top Layer w0.381: 86.9,34.91 86.9,32.75
  Top Layer w0.508: AMS1117.1 50.94,35.53 52.54,37.13 Cams5v.2
  vias: v1(11.52,41.26) v1(16.34,18.65) v1(16.34,17.92) v1(16.34,17.22) v1(16.47,16.6) v1(16.6,19.28) v1(16.6,15.85) v1(16.85,19.92) v1(17.11,15.35) v1(17.36,20.43) v1(17.61,28.68) v1(17.74,14.97) v1(18,20.81) v1(18.5,21.19) v1(18.49,14.97) v1(18.76,23.09) v1(18.76,22.46) v1(18.76,21.81) v1(19.25,14.97) v1(19.91,14.97) v1(20.59,14.97) v1(21.29,14.97) v1(21.42,39.73) v1(22.06,14.97) v1(22.72,14.97) v1(23.33,30.53) v1(23.42,14.97) v1(24.17,14.97) v1(24.89,14.97) v1(25.64,14.97) v1(26.29,14.97) v1(26.89,15.22) v1(27.01,21.06) v1(27.14,24.36) v1(27.52,20.56) v1(27.52,15.6) v1(28.03,20.05) v1(28.03,15.98) v1(28.41,19.54) v1(28.41,16.49) v1(28.79,18.95) v1(28.79,18.31) v1(28.79,17.64) v1(28.79,17) v1(28.92,23.48) v1(42.63,35.16) v1(59.27,25.64) v1(60.29,16.36) v1(60.29,15.66) v1(60.41,14.97) v1(60.54,17) v1(60.67,14.33) v1(60.92,17.51) v1(61.05,13.82) v1(61.3,18.02) v1(61.68,13.32) v1(61.81,18.4) v1(62.45,13.06) v1(63.13,13.06) v1(63.81,13.06) v1(64.52,13.06) v1(65.19,13.06) v1(65.85,13.06) v1(66.26,39.1) v1(66.53,13.06) v1(67.27,13.06) v1(67.94,13.06) v1(68.61,13.06) v1(69.33,13.06) v1(70,13.06) v1(70.7,13.32) v1(71.21,18.02) v1(71.34,13.7) v1(71.72,17.51) v1(71.84,14.2) v1(72.06,20.26) v1(72.22,16.91) v1(72.22,14.84) v1(72.35,16.21) v1(72.35,15.54) v1(72.61,30.59) v1(79.72,23.73) v1(84.16,24.94) v1(84.16,22.97) v1(84.16,20.42)
AIN: length 23.9
  Top Layer w0.254: R31.2 30.19,26.26 30.19,23.2 29.63,22.64 25.11,22.64 24.95,22.79 stlink.10 24.95,24.37 25.87,25.29 v1(25.87,25.89) ; R32.1 v1(17.49,27.79)
  Inner1 w0.254: v1(17.49,27.79) 20.54,27.79 22.44,25.89 v1(25.87,25.89)
ASRPRO_PA0: length 19.3
  Top Layer w0.254: v1(70.7,12.25) 71.16,12.25 73.37,14.46 73.37,24.24 72.22,25.39 MCU.18
  Bottom Layer w0.254: v1(70.7,12.25) 68.69,10.24 68.51,10.24
ASRPRO_PA1: length 23.3
  Top Layer w0.254: 65.97,10.24 67.4,11.67 71.21,11.67 73.74,14.19 73.74,24.76 72.61,25.89 MCU.19
ASRPRO_PA2: length 31.7
  Top Layer w0.254: MCU.12 69.89,21.39 v1(70.1,21.18)
  Inner1 w0.254: v1(59.08,38.25) 60.67,36.66 60.67,30.33 64.1,26.91 65.11,26.91 66.51,25.51 66.51,23.54 67.58,22.47 68.81,22.47 v1(70.1,21.18)
  Bottom Layer w0.254: ASRPRO.12 63.5,38.25 v1(59.08,38.25)
ASRPRO_PA3: length 19.5
  Top Layer w0.254: 63.18,40.72 62.93,40.72 57.87,35.67 57.87,28.62 59.11,27.39 MCU.39
BAT: length 8.6
  Top Layer w0.508: C23.1 95.21,12.23 BATTERY.2 ; L1.2 92.61,7.45 R9.2 92.65,9.67
BOOT0: length 7.4
  Top Layer w0.254: MCU.44 56.99,24.89 R4.2 boothigh空.1
BOOT1: length 26.3
  Top Layer w0.254: PB2LED.1 69.76,44.77 R5.2 67.27,42.28 67.27,39.1 v1(65.53,37.35) ; v1(69.34,26.43) 69.39,26.39 MCU.20
  Inner1 w0.254: v1(69.34,26.43) 69.34,26.79 67.78,28.35 67.78,35.1 v1(65.53,37.35)
DHT_DAT: length 74.4
  Top Layer w0.254: MCU.29 67.39,27.87 v1(67.47,27.78) ; v1(6.95,10.52) 6.95,10.59 4.66,12.87 DHT.2
  Bottom Layer w0.254: v1(6.95,10.52) 42.52,10.52 53.77,21.77 56.55,21.77 57.49,22.71 61.18,22.71 61.68,23.22 62.45,23.22 64.15,24.92 64.15,26.07 64.6,26.52 64.63,26.55 66.25,26.55 v1(67.47,27.78)
ENCODER_LA: length 68.9
  Top Layer w0.254: Motor_L.4 4.54,24.25 v1(5.66,25.37) ; MCU.40 59.1,26.89 58.2,27.79 55.17,27.79 54.79,28.17 50.63,28.17 v1(49.75,29.06)
  Bottom Layer w0.254: v1(5.66,25.37) 5.66,24.9 8.48,22.08 11.27,22.08 15.58,26.4 15.58,29.83 18,32.24 26.37,32.24 30.18,28.43 49.11,28.43 v1(49.75,29.06)
ENCODER_LB: length 68.2
  Top Layer w0.254: v1(49.87,27.93) 50.1,27.71 54.75,27.71 55.05,27.41 58,27.41 59.03,26.39 MCU.41
  Bottom Layer w0.254: v1(49.87,27.93) 30.18,27.93 26.25,31.86 18.12,31.86 15.94,29.68 15.94,26.12 11.52,21.7 8.36,21.7 4.53,25.52 Motor_L.3
ENCODER_RA: length 37.3
  Top Layer w0.254: MCU.45 64.32,24.39 v1(64.73,24.8)
  Bottom Layer w0.254: v1(64.73,24.8) 79.01,24.8 81.1,26.89 87.1,26.89 91.4,22.59 92.43,22.59 95.47,25.62 Motor_R.4
ENCODER_RB: length 35.4
  Top Layer w0.254: MCU.46 v1(65.24,23.89)
  Bottom Layer w0.254: v1(65.24,23.89) 65.71,24.35 89,24.35 91.66,21.7 92.8,21.7 95.35,24.25 Motor_R.3
IP5306_IN: length 45.1
  Top Layer w0.508: v1(77.56,8.36) Cip5306in.2 79.78,6.4 R8.2 80.74,7.22 83.07,7.22 IP5306.1
  Bottom Layer w0.508: POWER_SELECT.3 56.99,3.54 61.81,8.36 v1(77.56,8.36)
L+: length 4.7
  Top Layer w0.381: U6.2 7.28,24 Motor_L.6
L-: length 4.7
  Bottom Layer w0.381: Motor_L.1 7.28,26 U6.1
L_PWM: length 66.9
  Top Layer w0.254: Motor.2 11.95,6.16 v1(12.92,5.19) ; v1(68.29,20.3) 68.39,20.4 MCU.10
  Bottom Layer w0.254: v1(68.29,20.3) 66.96,21.63 61.95,21.63 61.26,20.94 53.94,20.94 42.63,9.63 21.81,9.63 17.36,5.19 v1(12.92,5.19)
L_TURN: length 72.6
  Top Layer w0.254: Motor.1 9.95,8.16 v1(8.34,9.76) ; v1(71.71,21.76) 71.71,22.09 70.91,22.89 MCU.13
  Bottom Layer w0.254: v1(8.34,9.76) 8.6,10.01 42.51,10.01 53.91,21.42 61.24,21.42 61.81,21.99 71.48,21.99 v1(71.71,21.76)
NRST: length 98.7
  Top Layer w0.254: Cnrst.1 74.38,18.84 v1(74.38,19.79) ; v1(67.08,20.24) 66.89,20.43 MCU.7 ; v1(29.04,27.67) 27.46,27.67 stlink.18 ; R1.2 74.38,30.29 v1(74.38,29.19) ; v1(9.23,39.48) 7.14,41.57 RESET.2
  Inner1 w0.254: v1(9.23,39.48) 9.87,39.48 10.49,38.86 13.91,38.86 20.16,32.62 20.16,28.94 22.57,26.52 27.9,26.52 v1(29.04,27.67) 36.48,20.24 62.62,20.24 63.32,19.54 63.84,19.54 64.54,20.24 v1(67.08,20.24) 67.85,19.47 74.06,19.47 v1(74.38,19.79) 74.38,24.36 73.13,25.62 73.13,27.94 v1(74.38,29.19)
OLED_CS: length 23
  Top Layer w0.254: MCU.27 68.39,31.13 v1(68.57,31.32)
  Inner1 w0.254: v1(68.57,31.32) 68.57,35.51 64.86,39.22 64.86,42.14 60.41,46.59 oled.7
OLED_DC: length 27.1
  Top Layer w0.254: v1(69.49,31.29) 68.89,30.68 MCU.26
  Inner1 w0.254: v1(63.14,45.51) 67.02,41.64 67.02,37.57 68.93,35.66 68.93,31.85 v1(69.49,31.29)
  Bottom Layer w0.254: oled.6 56.16,45.51 57.1,45.51 57.15,45.46 58.09,45.46 58.14,45.51 v1(63.14,45.51)
OLED_RES: length 32.7
  Top Layer w0.254: oled.5 52.54,46.21 53.81,44.94 58.51,44.94 59.97,46.4 v1(62.06,46.4) ; MCU.25 69.39,30.35 70.26,31.22 v1(70.26,31.6)
  Inner1 w0.254: v1(62.06,46.4) 64.41,46.4 69.56,41.26 69.56,32.24 70.19,31.6 v1(70.26,31.6)
OSC_IN: length 6.3
  Top Layer w0.254: 63.93,15.86 63.93,17.79 C12.2 65.89,19.74 MCU.5
OSC_OUT: length 6.5
  Top Layer w0.254: C13.2 68.83,17.79 X1.2 ; 67.15,19.28 66.39,20.04 MCU.6
PA1: length 69.8
  Top Layer w0.254: v1(22.44,8.87) 21.04,7.47 21.04,5.57 20.54,5.06 16.6,5.06 15.95,5.71 Motor.4 ; v1(71.31,20.05) 69.52,20.05 68.89,20.68 MCU.11
  Bottom Layer w0.254: v1(71.31,20.05) 68.86,20.05 68.47,19.65 66.84,19.65 65.22,21.28 62.1,21.28 61.4,20.58 54.09,20.58 42.79,9.28 22.85,9.28 v1(22.44,8.87)
PA4: length 46.7
  Top Layer w0.254: MCU.14 72.06,23.39 72.61,22.84 72.61,21.58 v1(72.17,21.14) ; v1(93.69,32.24) 94.52,33.07 94.52,36.71 97.65,39.84 SW1.2
  Inner1 w0.254: v1(72.17,21.14) 72.33,21.3 72.33,29.04 76.47,33.18 92.75,33.18 v1(93.69,32.24)
PA5: length 36.5
  Top Layer w0.254: MCU.15 70.19,23.89 67.55,26.52 v1(67.53,26.52)
  Inner1 w0.254: oled.3 47.59,46.59 54.83,39.35 60.54,39.35 62.06,37.82 62.09,31.58 67.15,26.52 v1(67.53,26.52)
PA6: length 45.5
  Top Layer w0.254: v1(72.78,20.49) 73.01,20.72 73.01,23.2 71.82,24.39 MCU.16 ; 97.73,38.23 97.62,38.12 v1(97.62,36.43)
  Inner1 w0.254: v1(72.78,20.49) 72.78,20.5 72.78,28.85 76.54,32.62 92.16,32.62 93.18,31.6 94.52,31.6 94.54,31.59 97.62,34.68 v1(97.62,36.43)
PA7: length 36.1
  Top Layer w0.254: 72.1,24.87 70.9,24.87 MCU.17 69.8,24.89 68.16,26.52 v1(68.16,27.13)
  Inner1 w0.254: v1(68.16,27.13) 67.05,27.13 62.95,31.22 62.95,37.7 60.92,39.73 55.33,39.73 50,45.07 oled.4
PA9: length 78.7
  Top Layer w0.254: v1(29.04,26.02) 28.2,25.17 stlink.13 ; v1(69.05,23.06) 68.81,23.06 66.89,24.98 MCU.30
  Inner1 w0.254: v1(58.46,29) 59.21,29 66.26,21.95 68.5,21.95 69.86,20.59 70.43,20.59 70.69,20.85 70.69,21.42 v1(69.05,23.06)
  Bottom Layer w0.254: usart1.1 85.05,19.28 80.86,19.28 77.09,23.06 v1(69.05,23.06) ; 58.45,29 56.79,27.35 30.38,27.35 v1(29.04,26.02)
PA10: length 72.7
  Top Layer w0.254: v1(28.79,24.87) 27.59,23.67 stlink.12 ; v1(67.4,23.64) 67.24,23.64 66.38,24.49 66.38,29.88 MCU.31 66.38,29.89 66.38,31.56 v1(66.34,31.6)
  Inner1 w0.254: v1(59.27,31.48) 58.9,31.48 v1(54.06,26.64)
  Bottom Layer w0.254: v1(28.79,24.87) 30.85,26.93 53.77,26.93 v1(54.06,26.64) ; v1(59.27,31.48) 59.4,31.6 v1(66.34,31.6) ; v1(67.4,23.64) 77.9,23.64 79.59,21.95 85.18,21.95 usart1.2
PA11: length 7.5
  Top Layer w0.254: MCU.32 65.89,31.23 65.39,31.73 61.62,31.73 61.3,32.04 R37.1
PA12: length 7.7
  Top Layer w0.254: R38.1 59.83,32.94 61.45,31.32 64.76,31.32 65.39,30.69 MCU.33
PA13: length 54
  Top Layer w0.254: v1(42.55,39.67) 40.33,41.89 35.65,41.89 SWD.2 ; stlink.27 24.95,33.03 24.6,33.38 24.6,33.75 R21.2 26.12,35.28 v1(26.12,35.32) ; MCU.34 64.86,29.86 v1(64.86,27.67)
  Bottom Layer w0.254: SWD.2 34.12,39.61 33.24,38.72 31.84,38.72 28.44,35.32 v1(26.12,35.32) ; v1(42.55,39.67) 43.05,39.67 48.32,34.4 54.13,34.4 60.86,27.67 v1(64.86,27.67)
PA14: length 56.1
  Top Layer w0.254: MCU.37 60.97,28.39 v1(58.89,30.46) ; stlink.15 26.48,26.17 25.11,27.54 25.11,30.78 25.45,31.12 stlink.26 25.45,33.35 v1(25.49,33.38) ; SWD.1 33.47,42.25 40.98,42.25 v1(42.76,40.47)
  Inner1 w0.254: SWD.1 30.7,39.48 30.7,37.95 26.12,33.38 v1(25.49,33.38)
  Bottom Layer w0.254: v1(42.76,40.47) 48.27,34.96 54.39,34.96 v1(58.89,30.46)
PA15: length 59.3
  Top Layer w0.254: Motor.3 13.95,10.16 v1(15.08,11.28) ; v1(59.02,28.3) 60.29,28.3 60.7,27.89 MCU.38
  Bottom Layer w0.254: v1(59.02,28.3) 59.02,27.53 42.37,10.88 15.48,10.88 v1(15.08,11.28)
PB6: length 37
  Top Layer w0.254: MPU.23 80.56,37.21 ; 80.56,37.21 80.56,37.66 IIC空.1 83.52,40.62 86.07,40.62 86.85,39.84 86.85,39.47 ; 80.56,37.21 80.58,37.19 v1(80.99,37.19) ; v1(64.88,25.97) 64.79,25.89 MCU.42
  Bottom Layer w0.254: v1(80.99,37.19) 80.23,37.19 77.56,34.53 77.56,28.81 74.49,25.74 66.53,25.74 66.3,25.97 v1(64.88,25.97)
PB7: length 42
  Top Layer w0.254: 79.59,36.94 80.06,36.47 MPU.24 ; 79.59,36.94 79.98,37.33 IIC空.2 80.26,38.59 82.65,40.98 88.88,40.98 R13.1 ; 79.59,36.94 78.45,36.94 77.18,35.67 v1(77.18,27.54) ; MCU.43 v1(65.48,25.39)
  Bottom Layer w0.254: v1(65.48,25.39) 65.48,25.38 75.65,25.38 77.18,26.91 v1(77.18,27.54)
PB10: length 57.9
  Top Layer w0.254: MCU.21 73.26,26.89 v1(73.75,26.4) ; v1(38.82,18.9) 37,18.9 JY901S.3
  Inner1 w0.254: 79.59,20.56 81.88,20.56 ; 79.59,20.56 77.43,20.56 75.63,18.75 62.73,18.75 61.96,19.52 42.11,19.52 41.49,18.9 v1(38.82,18.9) ; 79.59,20.56 v1(73.75,26.4)
PB11: length 61.4
  Top Layer w0.254: v1(41.24,19.65) 37.69,16.11 JY901S.4 ; v1(77.56,21.19) 79.46,23.09 usart3.2 ; MCU.22 v1(73.72,27.39)
  Inner1 w0.254: usart3.2 78.01,23.09 v1(73.72,27.39) ; v1(77.56,21.19) 75.48,19.11 62.87,19.11 62.1,19.88 41.47,19.88 v1(41.24,19.65)
PB15: length 33.7
  Top Layer w0.254: SW3.2 96.63,33.13 v1(95.11,33.13) ; MCU.28 67.91,29.91 67.91,31.6 68.67,32.37 v1(71.59,32.37)
  Inner1 w0.254: v1(71.59,32.37) 73.57,34.35 93.89,34.35 v1(95.11,33.13)
PC13: length 40.4
  Top Layer w0.254: v1(63.59,20.22) 63.59,20.23 63.72,20.36 64.06,20.36 64.39,20.68 MCU.2 ; v1(73.5,45.45) 73.54,45.45 PC13LED.1
  Inner1 w0.254: v1(63.59,20.22) 64.02,20.22 65.37,21.57 68.38,21.57 69.71,20.24 70.58,20.24 71.08,20.74 71.08,31.98 70.14,32.92 70.14,42.1 v1(73.5,45.45)
R+: length 4.6
  Top Layer w0.381: U7.2 94.79,28.75 Motor_R.6
R-: length 4.6
  Top Layer w0.381: Motor_R.1 94.79,21.25 U7.1
ST_USB+: length 32
  Top Layer w0.254: VCP1.6 11.27,43.33 11.27,44.05 11.01,44.3 10.5,44.3 10.26,44.06 VCP1.8 10.26,41.46 10.18,41.38 v1(10.18,41.32) ; v1(29.17,30.72) R26.2 ; stlink.33 21.95,33.17 v1(21.67,33.46)
  Inner1 w0.254: v1(21.67,33.46) 21.49,33.64 20.03,33.64 14.45,39.22 10.64,39.22 10.18,39.68 v1(10.18,41.32)
  Bottom Layer w0.254: v1(29.17,30.72) 28.4,30.72 26.52,32.59 22.53,32.59 v1(21.67,33.46)
ST_USB-: length 21.2
  Top Layer w0.254: VCP1.5 11.77,43.31 11.77,42.53 11.52,42.27 11.14,42.27 10.76,42.65 ; v1(22.43,33.6) 22.45,33.57 stlink.32 ; v1(10.81,40.44) 10.76,40.49 10.76,42.65 ; VCP1.7 10.76,42.65
  Inner1 w0.254: v1(10.81,40.44) 10.81,39.93 11.11,39.62 14.61,39.62 20.2,34.04 21.98,34.04 v1(22.43,33.6)
ST_VBUS: length 21.6
  Top Layer w0.508: VCP1.2 v1(13.41,42.02) ; 8.61,43.33 v1(8.61,41.37) ; v1(18.41,37.8) D6.1 17.01,34.91 F1.1
  Bottom Layer w0.508: 13.49,39.73 13.41,39.81 v1(13.41,42.02) ; 13.49,39.73 10.25,39.73 v1(8.61,41.37) ; 13.49,39.73 16.47,39.73 v1(18.41,37.8)
STLINK_LED: length 26.4
  Top Layer w0.254: v1(10.38,28.56) 10.38,30.2 R34.1 R33.1 ; stlink.30 23.45,31.35 24.6,30.21 24.6,27.41 v1(22.38,25.19)
  Inner1 w0.254: v1(22.38,25.19) 21.55,24.36 13.68,24.36 10.38,27.67 v1(10.38,28.56)
STLINK_NRST: length 10.8
  Top Layer w0.254: stlink.7 23.45,22.84 24.01,22.29 30.3,22.29 R30.2 31.01,23 Cst_nrst1.1
STLINK_SWCLK: length 17.5
  Top Layer w0.254: v1(23.33,28.43) 23.2,28.3 22.02,28.3 19.65,30.67 stlink.37
  Inner1 w0.254: STLINK_SWD.4 31.46,35.28 24.61,28.43 v1(23.33,28.43)
STLINK_SWDIO: length 19.6
  Top Layer w0.254: v1(23.97,29.01) 23.89,28.93 23.88,28.93 21.45,31.36 stlink.34
  Inner1 w0.254: v1(23.97,29.01) 24.55,29.01 30.33,34.79 30.33,36.9 30.99,37.56 32.87,37.56 STLINK_SWD.3
USB_DM: length 57.8
  Top Layer w0.254: v1(37.83,38.83) 37.44,39.22 24.47,39.22 21.68,42.01 VCP.7 21.75,43.25 21.75,42.66 22.02,42.4 22.44,42.4 22.68,42.64 VCP.5 ; v1(33.99,42.86) 33.16,42.86 32.74,43.27 VCP_micro.2 ; R37.2 61.3,34.94 61.27,34.97 v1(61.27,36.05)
  Inner1 w0.254: v1(61.27,36.05) 61.3,36.08 61.3,38.08 60.55,38.83 v1(37.83,38.83) 36.55,38.83 35.4,39.99 35.4,41.46 v1(33.99,42.86)
USB_DP: length 67.9
  Top Layer w0.254: v1(38.49,38.25) 37.51,38.25 36.95,38.82 24.31,38.82 21.18,41.94 VCP.8 21.18,43.94 21.55,44.3 21.93,44.3 22.18,44.05 VCP.6 ; v1(59.9,35.92) 59.9,35.04 59.83,34.97 R38.2 ; VCP_micro.3 32.06,44.83 v1(32.06,42.98) ; R39.1 57.33,29.16 v1(57.33,35.95)
  Inner1 w0.254: v1(57.33,35.95) 59.87,35.95 v1(59.9,35.92) 59.9,35.93 57.58,38.25 v1(38.49,38.25) 38.38,38.13 34.76,38.13 32.73,40.17 32.73,42.27 32.06,42.94 v1(32.06,42.98)
USB_RENUMN: length 23.9
  Top Layer w0.254: v1(23.33,33.64) 22.69,34.27 20.41,34.27 17.36,31.22 17.36,30.46 17.65,30.17 stlink.38 ; v1(35.4,33.69) 36.15,32.93 R29.2
  Bottom Layer w0.254: v1(23.33,33.64) 23.66,33.97 35.12,33.97 v1(35.4,33.69)
$1N940: length 9.7
  Top Layer w0.254: POWER.B5 54.42,15.44 R11.2
$1N945: length 13
  Top Layer w0.254: POWER.A5 51.42,14.47 R10.1
$1N1477: length 10.7
  Top Layer w0.254: R14.2 89.12,31.75 v1(88.86,31.49) ; MPU.9 81.06,31.28 v1(81.24,31.1)
  Bottom Layer w0.254: v1(88.86,31.49) 87.77,30.4 81.94,30.4 v1(81.24,31.1)
$1N1848: length 10.2
  Top Layer w0.254: C25.2 89.05,34.33 v1(88.48,33.76) ; MPU.10 81.56,31.75 v1(82.29,31.01)
  Bottom Layer w0.254: v1(82.29,31.01) 85.73,31.01 v1(88.48,33.76)
$1N1890: length 4.4
  Top Layer w0.254: C27.2 85.39,37.42 82.66,37.42 82.06,36.81 MPU.20
$1N5535: length 18.4
  Top Layer w0.254: MT3608.1 18.82,11.34 13.18,16.99 D5.2
  Top Layer w0.381: MT3608.1 18.82,10.58 19.48,9.93 26.91,9.93 L2.1
$1N5567: length 13.1
  Top Layer w0.254: v1(20.79,12.17) 20.79,11.09 MT3608.3 ; R15.1 12.35,11.73 R16.2 v1(12.42,13.01)
  Inner1 w0.254: v1(12.42,13.01) 19.95,13.01 v1(20.79,12.17)
$1N12513: length 5.7
  Top Layer w0.254: JY_Reset.1 44.97,27.29 JY901S.12
$2N1682: length 8.9
  Top Layer w0.254: v1(24.73,39.99) 24.6,39.99 23.18,41.4 VCP.4 ; R35.2 26.12,36.8 v1(26.12,36.81)
  Bottom Layer w0.254: v1(26.12,36.81) 26.12,38.59 v1(24.73,39.99)
$2N1703: length 11.4
  Top Layer w0.254: VCP.10 20.18,39.2 20.92,38.46 26.06,38.46 R36.2
$2N4715: length 5.9
  Top Layer w0.381: IP5306.5 88.34,11.61 89.8,13.06 92.42,13.06 92.69,12.79 92.69,12.15 R7.2
$2N4720: length 27.2
  Top Layer w0.381: v1(69.94,4.68) 68.6,3.35 POWER_DISPLAY.2 ; R7.1 90.39,12.05 v1(90,11.67)
  Bottom Layer w0.381: v1(69.94,4.68) 83.02,4.68 v1(90,11.67)
$2N4867: length 2.2
  Top Layer w0.381: C16.2 81.36,4.23 R8.1
$2N5169: length 17.2
  Top Layer w0.381: IP5306.2 85.77,5.02 83.4,2.65 78.7,2.65 77.31,4.04 74.4,4.04 D2.1 73.13,3 D1.2
$2N5174: length 19
  Top Layer w0.381: D1.1 73.13,1.5 D2.2 D3.1 D4.2 77.06,1.66 84.72,1.66 88.31,5.25 IP5306.4
$2N5218: length 14.2
  Top Layer w0.381: IP5306.3 87.04,5.25 83.93,2.14 78.32,2.14 77.57,2.89 D4.1 D3.2
$2N5524: length 9.6
  Top Layer w0.381: L1.1 91.21,5.51 90.26,6.46 90.26,8.18 88.2,10.24 86.18,10.24 85.77,10.65 IP5306.7
$2N5554: length 10.9
  Top Layer w0.254: R9.1 91.15,7.89 88.37,10.66 87.96,10.66 87.73,10.89 87.73,10.92 IP5306.6
  Top Layer w0.381: C22.2 90.07,14.02 88.6,12.55 87.72,12.55 87.04,11.88 IP5306.6
$2N9914: length 4.4
  Top Layer w0.254: R6.2 65.78,44.73 POWER1.1
$2N9917: length 4.1
  Top Layer w0.254: PB2LED.2 72.47,47.3 R18.2
$2N9920: length 4.8
  Top Layer w0.254: R17.2 78.15,45.92 78.15,47.86
$3N635: length 6.8
  Top Layer w0.254: stlink.5 22.45,22.15 C30.2 21.74,19.51 X2.1
$3N637: length 6.6
  Top Layer w0.254: stlink.6 22.95,22.26 C31.2 23.77,19.13 X2.2
$3N644: length 14.3
  Top Layer w0.254: R19.2 29.66,29.92 v1(29.65,29.92) ; v1(22.29,27.63) 20.95,26.29 stlink.2
  Inner1 w0.254: v1(29.65,29.92) 27.47,27.74 22.4,27.74 v1(22.29,27.63)
$3N649: length 17.1
  Top Layer w0.254: stlink.3 21.45,25.54 v1(23.08,27.16) ; R20.2 34.13,29.06 v1(33.36,29.06)
  Inner1 w0.254: v1(23.08,27.16) 27.71,27.16 29.04,28.49 32.79,28.49 v1(33.36,29.06)
$3N1080: length 2.7
  Top Layer w0.254: R21.1 26.88,33.88 25.95,32.96 stlink.25
$3N1266: length 3.5
  Top Layer w0.254: R22.1 15.66,29.32 17.36,29.32 17.71,29.67 stlink.39
$3N1347: length 3.6
  Top Layer w0.254: R23.1 16.7,27.17 stlink.44
$3N2380: length 7.7
  Top Layer w0.254: Q1.2 37.66,29.06 34.76,29.06 33.11,30.72 R26.1
$3N2705: length 9.7
  Top Layer w0.254: 40.66,30.17 40.66,31.66 R28.1 38.56,30.96 37.03,30.96 R27.2 34.64,32.09 R29.1
$3N3720: length 7.4
  Top Layer w0.254: R33.2 7.07,33.77 7.07,36.43 8.22,37.57 st_blue.1
$3N3725: length 5.2
  Top Layer w0.254: R34.2 9.61,30.96 9.61,32.87 10.84,34.1 st_red.1
$3N5124: length 8.4
  Top Layer w0.254: R40.2 11.35,38.63 9.26,40.72 VCP1.10
$3N5164: length 10.5
  Top Layer w0.254: R41.2 16.85,37.83 16.85,39.22 16.22,39.86 13.42,39.86 12.26,41.02 VCP1.4

## Copper pours and planes (outline as drawn; the poured copper is in the pictures)
GND on Top Layer: -12.99,67.16 118.07,67.16 118.07,-15.39 -12.99,-15.39
GND on Bottom Layer: -8.93,66.4 109.69,66.4 109.69,-5.73 -8.93,-5.73
GND on Inner1: -7.4,55.86 105.63,55.86 105.63,-6.5 -7.4,-6.5
GND on Inner2: -9.31,60.43 107.53,60.43 107.53,-11.96 -9.31,-11.96
